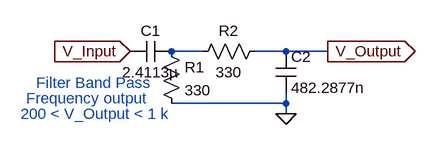
[diagram p0: schematic Band_Pass_200_1k.asc]
Band_Pass_200_1k.asc, the LTspice schematic file:
Version 4
SHEET 1 880 680
WIRE 64 112 16 112
WIRE 192 112 144 112
WIRE 256 112 192 112
WIRE 192 192 192 176
WIRE 192 192 16 192
WIRE 192 208 192 192
FLAG -48 112 V_Input
IOPIN -48 112 In
FLAG 256 112 V_Output
IOPIN 256 112 Out
FLAG 192 208 0
SYMBOL cap 16 96 R90
WINDOW 0 0 32 VBottom 2
WINDOW 3 32 32 VTop 2
SYMATTR InstName C1
SYMATTR Value 2.4113µ
SYMBOL res 0 96 R0
SYMATTR InstName R1
SYMATTR Value 330
SYMBOL res 160 96 R90
WINDOW 0 0 56 VBottom 2
WINDOW 3 32 56 VTop 2
SYMATTR InstName R2
SYMATTR Value 330
SYMBOL cap 176 112 R0
SYMATTR InstName C2
SYMATTR Value 482.2877n
TEXT -192 160 Left 2 ;Filter Band Pass
TEXT -208 184 Left 2 ;Frequency output
TEXT -216 208 Left 2 ;200 < V_Output < 1 k

The netlist it stands for:
* Band_Pass_200_1k.asc
C1 N001 V_Input 2.4113µ
R1 N001 0 330
R2 V_Output N001 330
C2 V_Output 0 482.2877n
* Filter Band Pass
* Frequency output
* 200 < V_Output < 1 k
.backanno
.end